# Altium schematic sheet GumstixEthernetInterface.SchDoc
size B
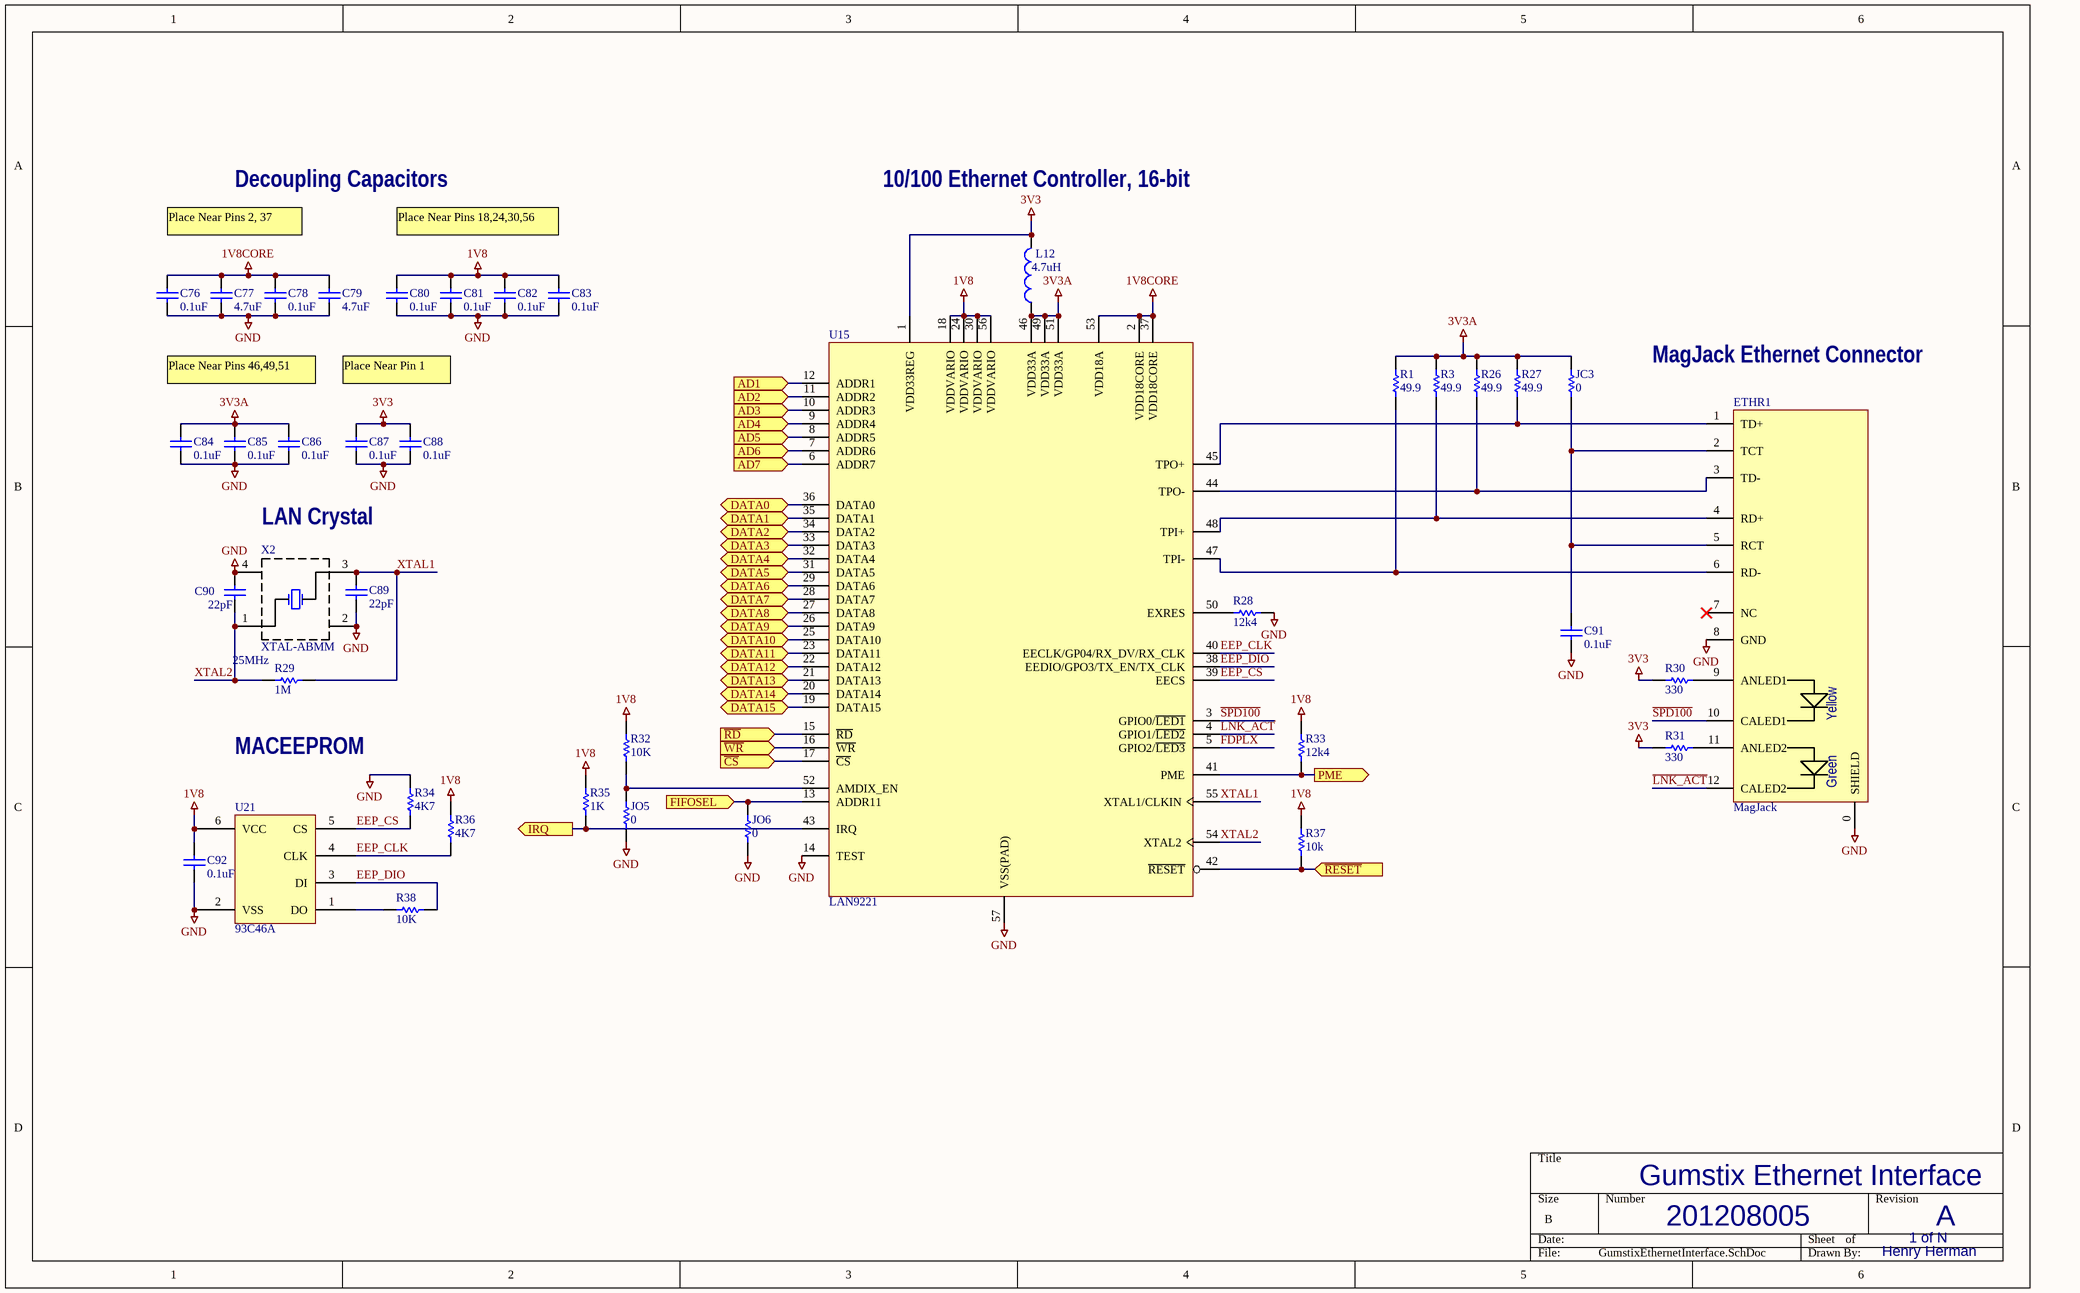
[diagram p0: GumstixEthernetInterface.SchDoc]

## Parts
C76  Label: 0.1uF  [SM/C_0402]  (hidden comment: CAP)
C77  Label: 4.7uF  [SM/C_0603]  (hidden comment: CAP)
C78  Label: 0.1uF  [SM/C_0402]  (hidden comment: CAP)
C79  Label: 4.7uF  [SM/C_0603]  (hidden comment: CAP)
C80  Label: 0.1uF  [SM/C_0402]  (hidden comment: CAP)
C81  Label: 0.1uF  [SM/C_0402]  (hidden comment: CAP)
C82  Label: 0.1uF  [SM/C_0402]  (hidden comment: CAP)
C83  Label: 0.1uF  [SM/C_0402]  (hidden comment: CAP)
C84  Label: 0.1uF  [SM/C_0402]  (hidden comment: CAP)
C85  Label: 0.1uF  [SM/C_0402]  (hidden comment: CAP)
C86  Label: 0.1uF  [SM/C_0402]  (hidden comment: CAP)
C87  Label: 0.1uF  [SM/C_0402]  (hidden comment: CAP)
C88  Label: 0.1uF  [SM/C_0402]  (hidden comment: CAP)
C89  Label: 22pF  [SM/C_0402]  (hidden comment: CAP)
C90  Label: 22pF  [SM/C_0402]  (hidden comment: CAP)
C91  Label: 0.1uF  [SM/C_0402]  (hidden comment: CAP)
C92  Label: 0.1uF  [SM/C_0603]  (hidden comment: CAP)
ETHR1  MagJack  [MagJack]
JC3  value 0  [SM/R_0603]  (hidden comment: Res)
JO5  value 0  [SM/R_0603]  (hidden comment: Res)
JO6  value 0  [SM/R_0603]  (hidden comment: Res)
L12  value 4.7uH  [SM/L_0805]  (hidden comment: Inductor)
R1  value 49.9  [SM/R_0603]  (hidden comment: Res)
R3  value 49.9  [SM/R_0603]  (hidden comment: Res)
R26  value 49.9  [SM/R_0603]  (hidden comment: Res)
R27  value 49.9  [SM/R_0603]  (hidden comment: Res)
R28  value 12k4  [SM/R_0603]  (hidden comment: Res)
R29  value 1M  [SM/R_0603]  (hidden comment: Res)
R30  value 330  [SM/R_0603]  (hidden comment: Res)
R31  value 330  [SM/R_0603]  (hidden comment: Res)
R32  value 10K  [SM/R_0603]  (hidden comment: Res)
R33  value 12k4  [SM/R_0603]  (hidden comment: Res)
R34  value 4K7  [SM/R_0603]  (hidden comment: Res)
R35  value 1K  [SM/R_0603]  (hidden comment: Res)
R36  value 4K7  [SM/R_0603]  (hidden comment: Res)
R37  value 10k  [SM/R_0603]  (hidden comment: Res)
R38  value 10K  [SM/R_0603]  (hidden comment: Res)
U15  LAN9221  [QFN-56Pin-SMSC-LAN9221]
U21  93C46A  [SOT23-93C46-EEPROM-Microchip]
X2  XTAL-ABMM  value 25MHz  [ABMM-Crystal]

## Ports
AD1 (in), AD2 (in), AD3 (in), AD4 (in), AD5 (in), AD6 (in), AD7 (in), DATA0 (bidir), DATA1 (bidir), DATA2 (bidir), DATA3 (bidir), DATA4 (bidir), DATA5 (bidir), DATA6 (bidir), DATA7 (bidir), DATA8 (bidir), DATA9 (bidir), DATA10 (bidir), DATA11 (bidir), DATA12 (bidir), DATA13 (bidir), DATA14 (bidir), DATA15 (bidir), FIFOSEL (in), IRQ (out), PME (out), ~{CS} (in), ~{RD} (in), ~{RESET} (in), ~{WR} (in)

## Nets
1V8: C80.2 C81.2 C82.2 C83.2 C92.2 R32.2 R33.1 R35.2 R36.2 R37.1 U15.18(VDDVARIO) U15.24(VDDVARIO) U15.30(VDDVARIO) U15.56(VDDVARIO) U21.6(VCC)
1V8CORE: C76.2 C77.2 C78.2 C79.2 U15.2(VDD18CORE) U15.37(VDD18CORE) U15.53(VDD18A)
3V3: C87.2 C88.2 L12.2 R30.2 R31.2 U15.1(VDD33REG)
3V3A: C84.2 C85.2 C86.2 JC3.2 L12.1 R1.2 R3.2 R26.2 R27.2 U15.46(VDD33A) U15.49(VDD33A) U15.51(VDD33A)
GND: C76.1 C77.1 C78.1 C79.1 C80.1 C81.1 C82.1 C83.1 C84.1 C85.1 C86.1 C87.1 C88.1 C89.1 C90.2 C91.1 C92.1 ETHR1.0(SHIELD) ETHR1.8(GND) JO5.1 JO6.1 R28.2 R34.2 U15.14(TEST) U15.57(VSS(PAD)) U21.2(VSS) X2.2 X2.4
AD1: U15.12(ADDR1) ; port AD1
AD2: U15.11(ADDR2) ; port AD2
AD3: U15.10(ADDR3) ; port AD3
AD4: U15.9(ADDR4) ; port AD4
AD5: U15.8(ADDR5) ; port AD5
AD6: U15.7(ADDR6) ; port AD6
AD7: U15.6(ADDR7) ; port AD7
~{CS}: U15.17(~{CS}) ; port ~{CS}
DATA0: U15.36(DATA0) ; port DATA0
DATA1: U15.35(DATA1) ; port DATA1
DATA2: U15.34(DATA2) ; port DATA2
DATA3: U15.33(DATA3) ; port DATA3
DATA4: U15.32(DATA4) ; port DATA4
DATA5: U15.31(DATA5) ; port DATA5
DATA6: U15.29(DATA6) ; port DATA6
DATA7: U15.28(DATA7) ; port DATA7
DATA8: U15.27(DATA8) ; port DATA8
DATA9: U15.26(DATA9) ; port DATA9
DATA10: U15.25(DATA10) ; port DATA10
DATA11: U15.23(DATA11) ; port DATA11
DATA12: U15.22(DATA12) ; port DATA12
DATA13: U15.21(DATA13) ; port DATA13
DATA14: U15.20(DATA14) ; port DATA14
DATA15: U15.19(DATA15) ; port DATA15
EEP_CLK: R36.1 U15.40(EECLK/GP04/RX_DV/RX_CLK) U21.4(CLK)
EEP_CS: R34.1 U15.39(EECS) U21.5(CS)
EEP_DIO: R38.1 U15.38(EEDIO/GPO3/TX_EN/TX_CLK) U21.3(DI)
~{FDPLX}: U15.5(GPIO2/~{LED3})
FIFOSEL: JO6.2 U15.13(ADDR11) ; port FIFOSEL
IRQ: R35.1 U15.43(IRQ) ; port IRQ
~{LNK_ACT}: ETHR1.12(CALED2) U15.4(GPIO1/~{LED2})
PME: R33.2 U15.41(PME) ; port PME
~{RD}: U15.15(~{RD}) ; port ~{RD}
~{RESET}: R37.2 U15.42(~{RESET}) ; port ~{RESET}
~{SPD100}: ETHR1.10(CALED1) U15.3(GPIO0/~{LED1})
~{WR}: U15.16(~{WR}) ; port ~{WR}
XTAL1: C89.2 R29.2 U15.55(XTAL1/CLKIN) X2.3
XTAL2: C90.1 R29.1 U15.54(XTAL2) X2.1
NetC91_2: C91.2 ETHR1.2(TCT) ETHR1.5(RCT) JC3.1
NetETHR1_1: ETHR1.1(TD+) R27.1 U15.45(TPO+)
NetETHR1_3: ETHR1.3(TD-) R26.1 U15.44(TPO-)
NetETHR1_4: ETHR1.4(RD+) R3.1 U15.48(TPI+)
NetETHR1_6: ETHR1.6(RD-) R1.1 U15.47(TPI-)
NetETHR1_9: ETHR1.9(ANLED1) R30.1
NetETHR1_11: ETHR1.11(ANLED2) R31.1
NetJO5_2: JO5.2 R32.1 U15.52(AMDIX_EN)
NetR28_1: R28.1 U15.50(EXRES)
NetR38_2: R38.2 U21.1(DO)

Not connected (* = marked no-connect by the designer): ETHR1 7(NC)*

## Notes on the sheet
- Place Near Pins 2, 37
- Decoupling Capacitors
- Place Near Pins 18,24,30,56
- 10/100 Ethernet Controller, 16-bit
- MagJack Ethernet Connector
- Place Near Pins 46,49,51
- Place Near Pin 1
- LAN Crystal
- MACEEPROM
- Gumstix Ethernet Interface
- 201208005
- 1 of N
- A
- Henry Herman
- (in symbol MAGJACK-SI-60062) Yellow; Green

## Library data of the parts
C76 C78 C80-C88 C91 C92 = CAP: Value: 0.1uF
C77 C79 = CAP: Value: 4.7uF
C89 C90 = CAP: Value: 22pF
ETHR1 = MAGJACK-SI-60062
JC3 JO5 JO6 R1 R3 R26-R38 = Res: Resistor; Published: 8-Jun-2000; LatestRevisionDate: 17-Jul-2002; LatestRevisionNote: Re-released for DXP Platform.; PackageReference: AXIAL-0.3; Publisher: Altium Limited
U21 = 93CX6-EEPROM